# EAGLE design pengendali (EAGLE 7.6.0)
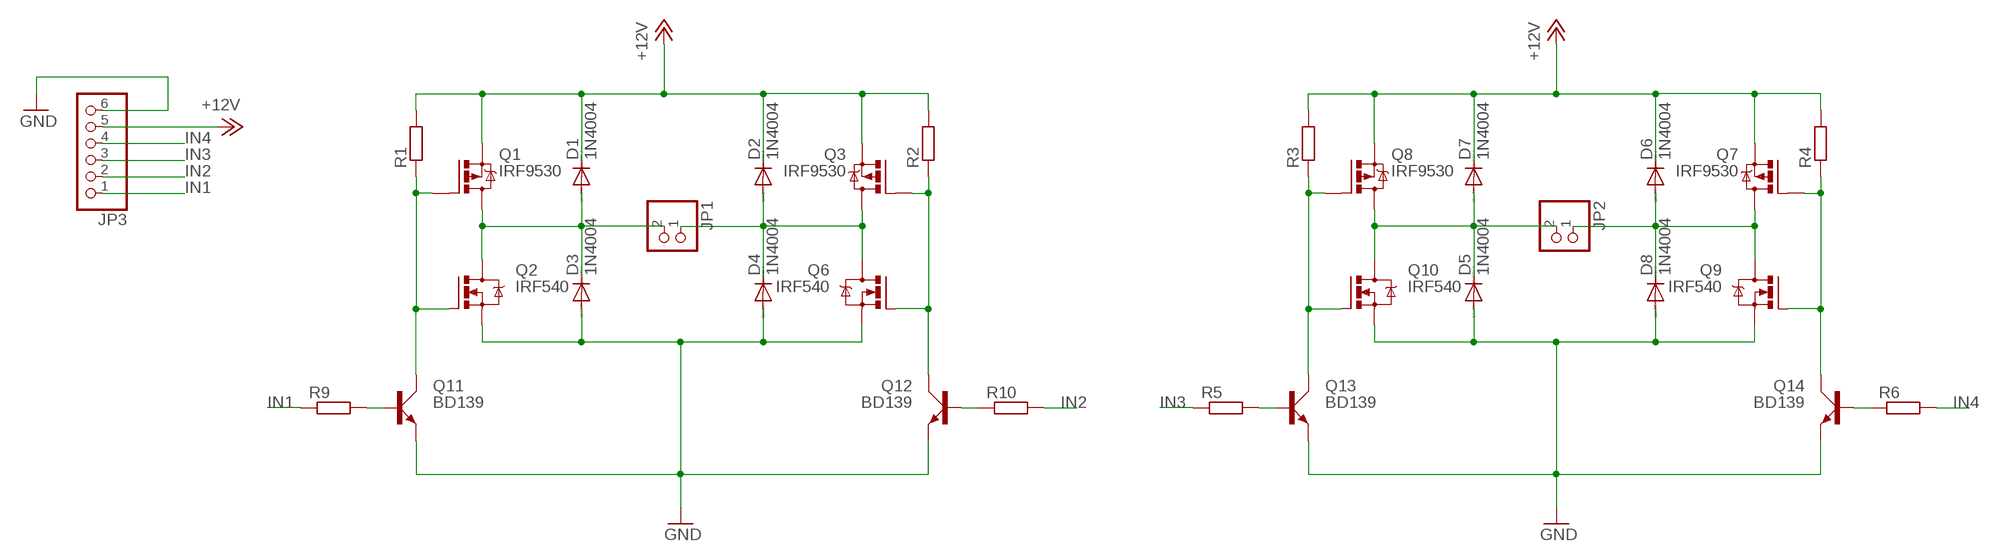
[diagram p0: schematic, sheet 1]

## Parts
D1  1N4004  [DO41-10]
D2  1N4004  [DO41-10]
D3  1N4004  [DO41-10]
D4  1N4004  [DO41-10]
D5  1N4004  [DO41-10]
D6  1N4004  [DO41-10]
D7  1N4004  [DO41-10]
D8  1N4004  [DO41-10]
JP1  PINHD-1X2  [1X02]
JP2  PINHD-1X2  [1X02]
JP3  PINHD-1X6  [1X06]
Q1  IRF9530  [TO220BV]
Q2  IRF540  [TO220BV]
Q3  IRF9530  [TO220BV]
Q6  IRF540  [TO220BV]
Q7  IRF9530  [TO220BV]
Q8  IRF9530  [TO220BV]
Q9  IRF540  [TO220BV]
Q10  IRF540  [TO220BV]
Q11  BD139  [TO126AV]
Q12  BD139  [TO126AV]
Q13  BD139  [TO126AV]
Q14  BD139  [TO126AV]
R1  R-EU_0204/7  [0204/7]
R2  R-EU_0204/7  [0204/7]
R3  R-EU_0204/7  [0204/7]
R4  R-EU_0204/7  [0204/7]
R5  R-EU_0204/7  [0204/7]
R6  R-EU_0204/7  [0204/7]
R9  R-EU_0204/7  [0204/7]
R10  R-EU_0204/7  [0204/7]

## Nets
+12V: D1.C D2.C D6.C D7.C JP3.5 Q1.S Q3.S Q7.S Q8.S R1.2 R2.2 R3.2 R4.2
GND: D3.A D4.A D5.A D8.A JP3.6 Q2.S Q6.S Q9.S Q10.S Q11.E Q12.E Q13.E Q14.E
IN1: JP3.1 R9.1
IN2: JP3.2 R10.2
IN3: JP3.3 R5.1
IN4: JP3.4 R6.2
N$3: Q1.G Q2.G Q11.C R1.1
N$4: Q8.G Q10.G Q13.C R3.1
N$6: Q3.G Q6.G Q12.C R2.1
N$7: Q11.B R9.2
N$8: Q12.B R10.1
N$9: D1.A D3.C JP1.2 Q1.D Q2.D
N$10: D2.A D4.C JP1.1 Q3.D Q6.D
N$11: Q13.B R5.2
N$12: Q14.B R6.1
N$15: Q7.G Q9.G Q14.C R4.1
N$17: D5.C D7.A JP2.2 Q8.D Q10.D
N$18: D6.A D8.C JP2.1 Q7.D Q9.D

## Library data of the parts
D1-D8 = diode:1N4004: DIODE general purpose rectifier, 1 A
JP1 JP2 = pinhead:PINHD-1X2: PIN HEADER
JP3 = pinhead:PINHD-1X6: PIN HEADER
Q1 Q3 Q7 Q8 = transistor-power:IRF9530: P-CHANNEL HEXFET POWER-MOS-FET Source: http://www.irf.com/product-info/datasheets/data/irf9530.pdf
Q2 Q6 Q9 Q10 = transistor-power:IRF540: HEXFET Power MOSFET
Q11-Q14 = transistor-power:BD139: NPN TRANSISTOR
R1-R6 R9 R10 = resistor:R-EU_: RESISTOR, European symbol

## Board
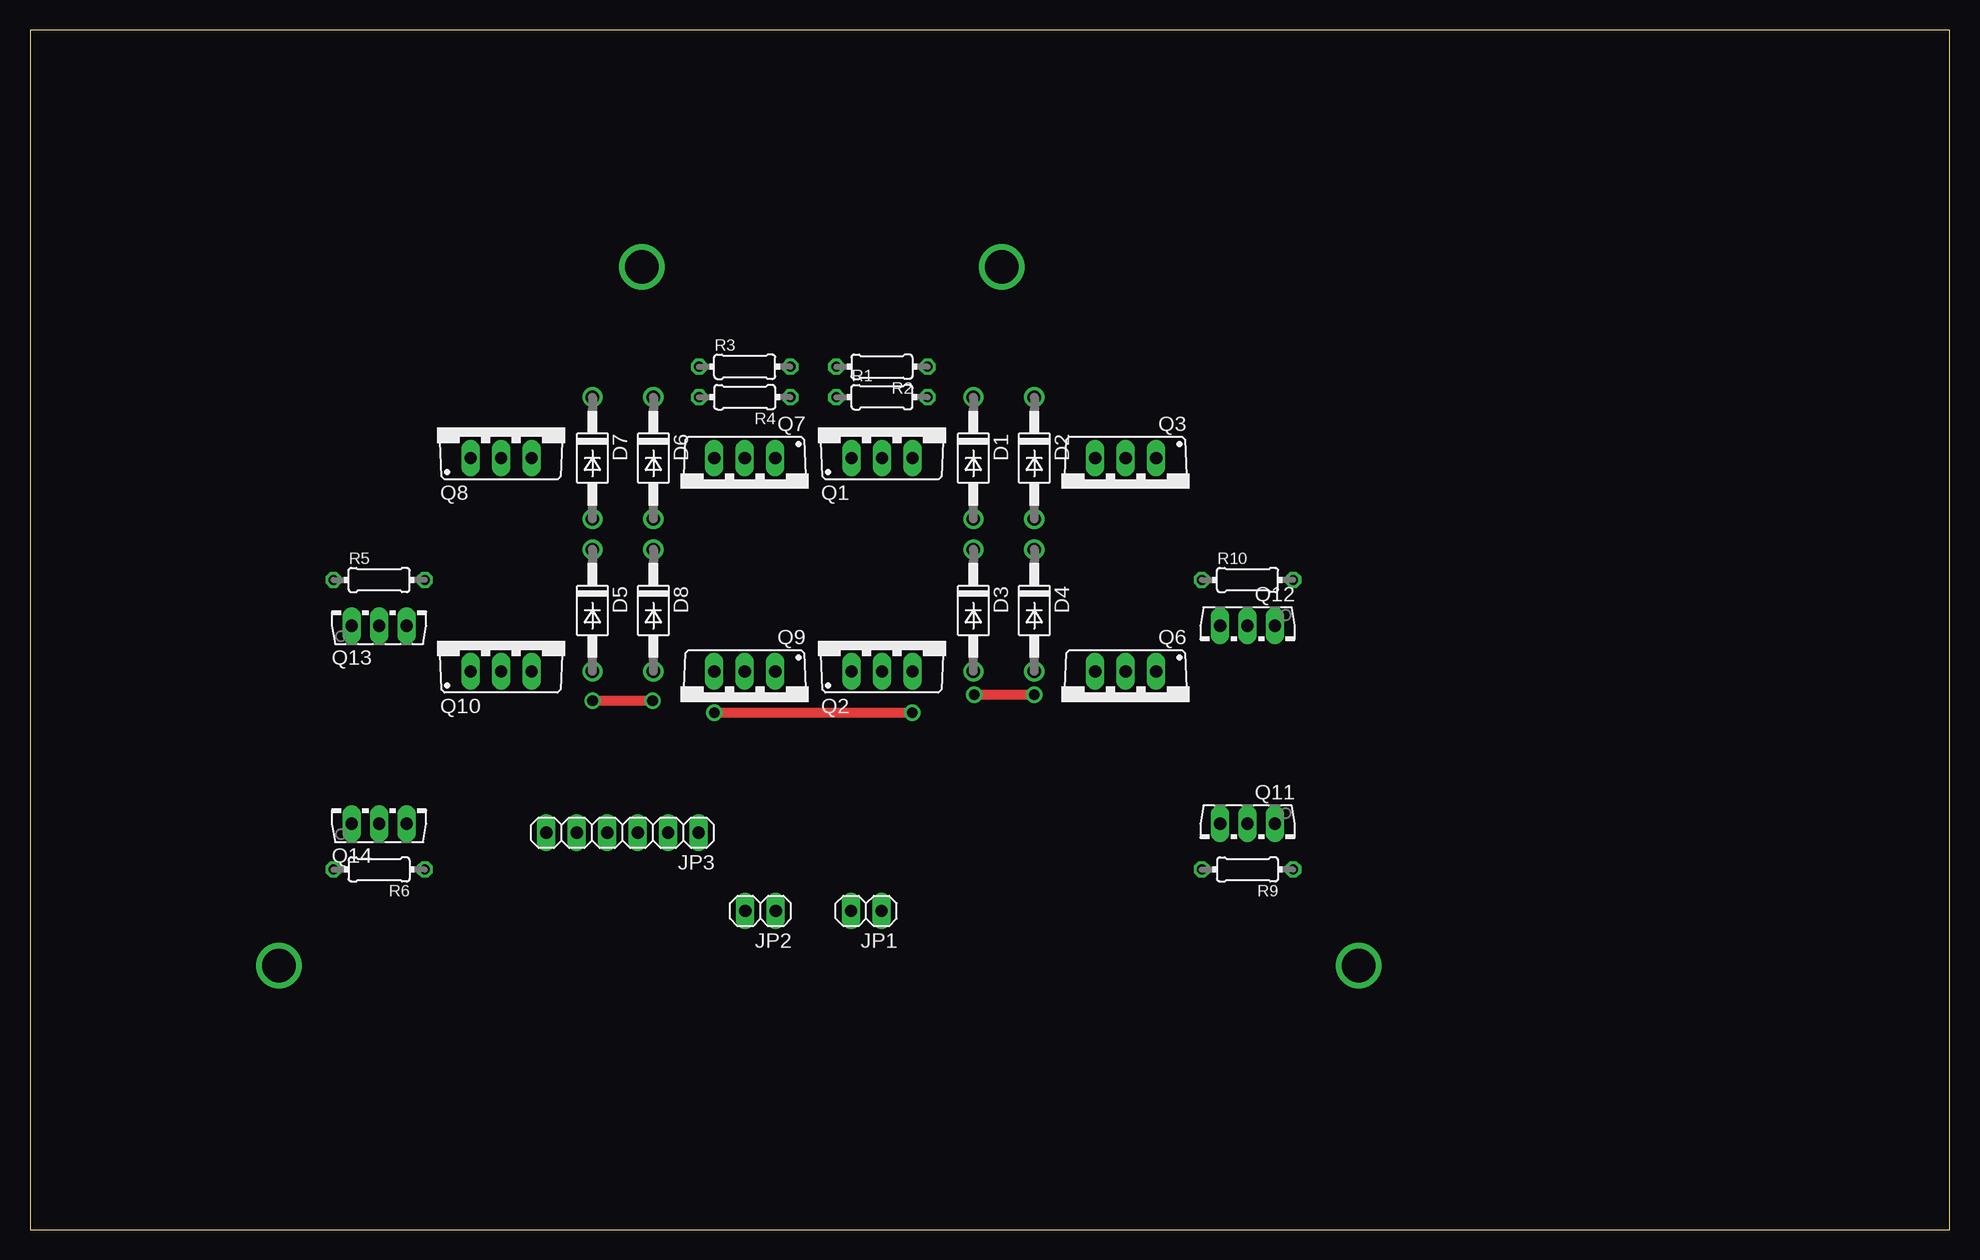
[diagram p1: board, top side]
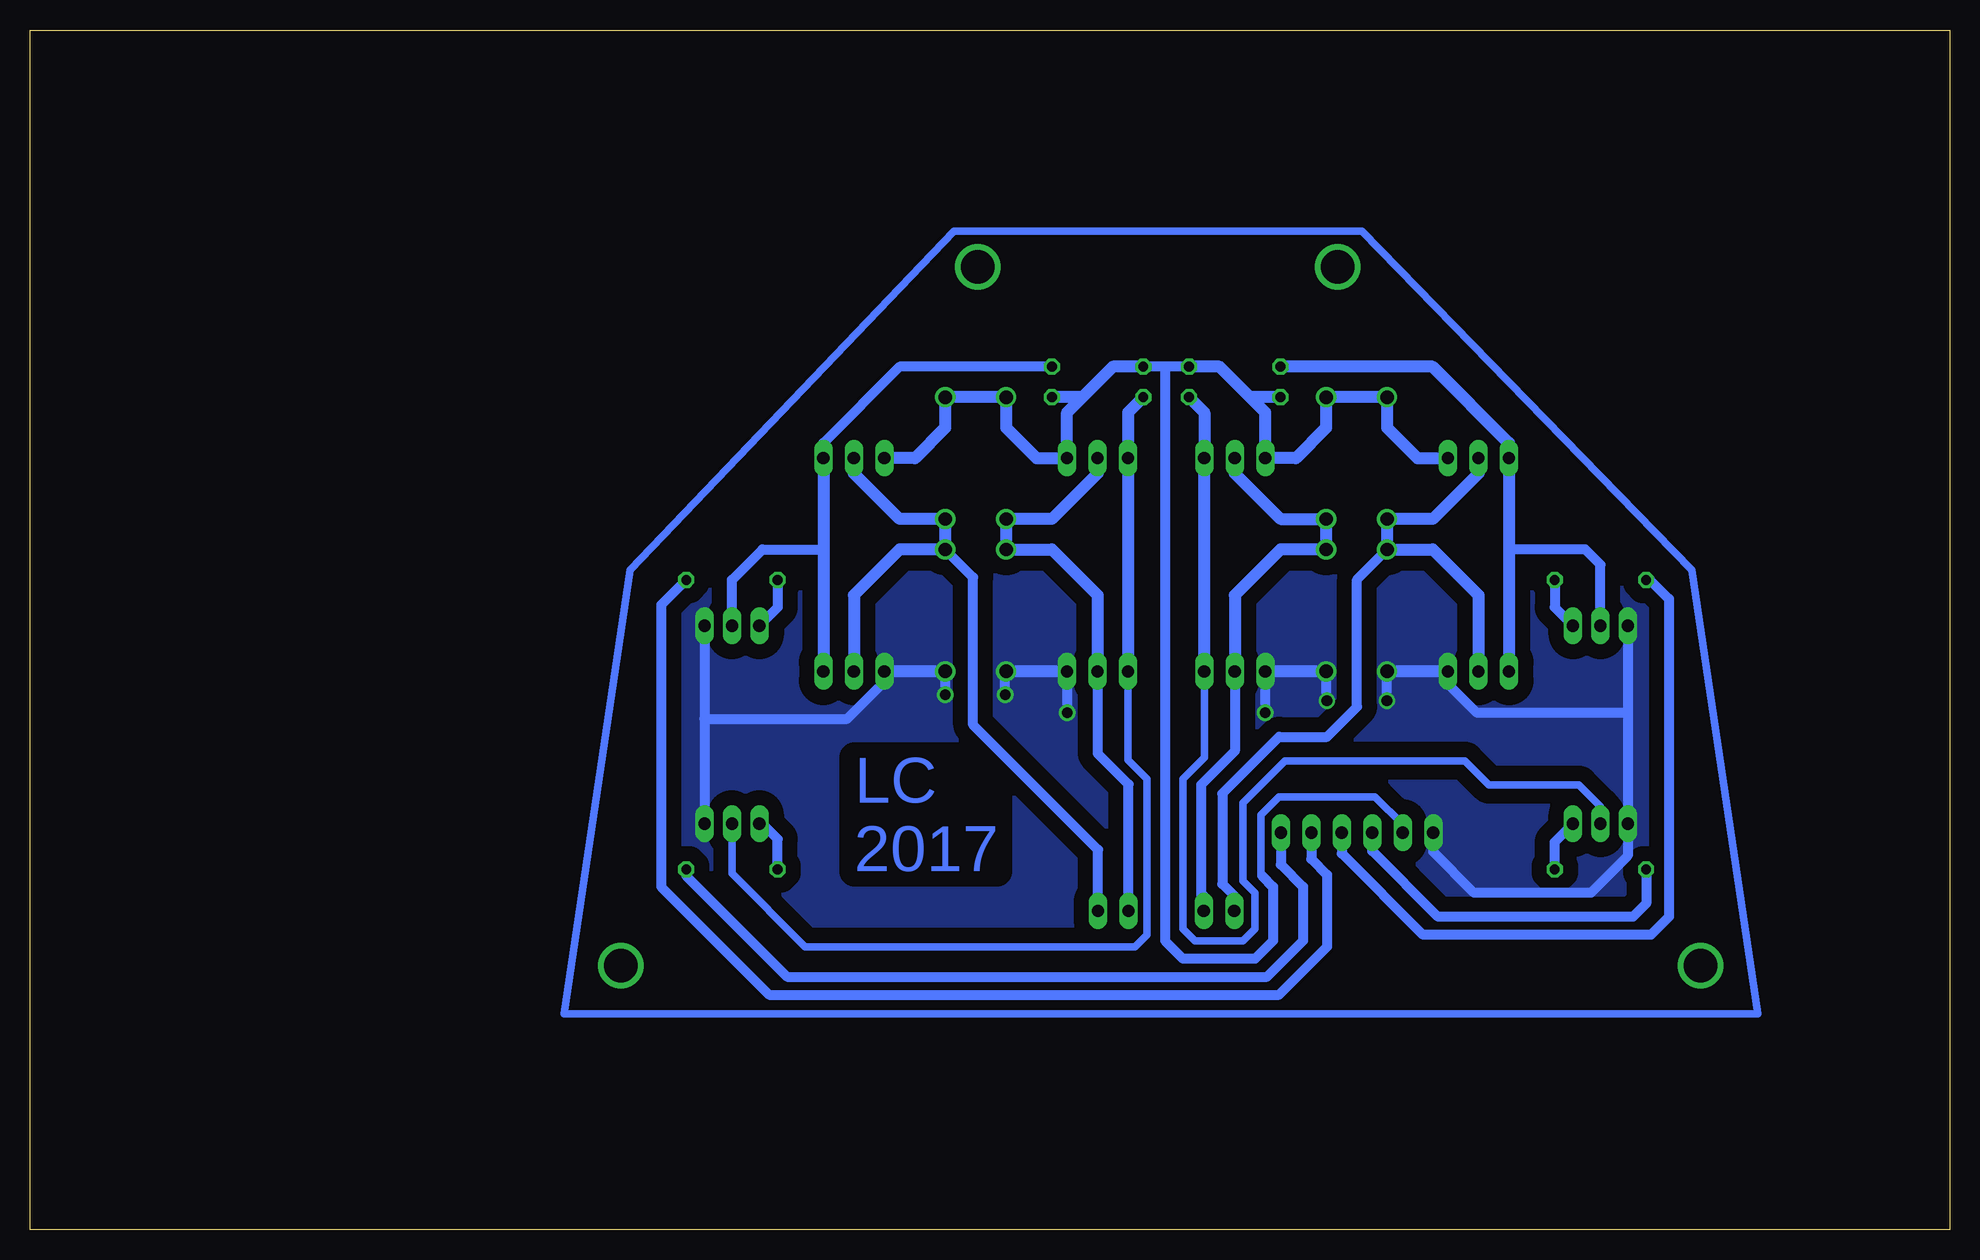
[diagram p2: board, bottom side, seen from below]

Size 160 x 100 mm. Coordinates in mm from the lower left corner, seen from the top.
Outline: 0,0 160,0 160,100 0,100 0,0
Copper layers (1*16): Top 0.035mm / dielectric 1.5mm / Bottom 0.035mm
Design rules "default": minimum track width 10mil, minimum drill 24mil, track to track 8mil, track to pad 8mil, pad to pad 8mil, via to via 8mil, smd to smd 8mil, copper to edge 40mil, drill to drill 8mil, minimum pad ring 10mil, minimum via ring 8mil, stop-mask expansion 4mil, vias tented up to drill 0mil, thermal gap 10mil

### Footprints (pad centres in the part's own frame; a part is rotated, then mirrored left to right if it is on the bottom)
DO41-10 = drill 1.118: A 5.08,0; C -5.08,0
1X02 = drill 1.016 long: 1 -1.27,0; 2 1.27,0
1X06 = drill 1.016 long: 1 -6.35,0; 2 -3.81,0; 3 -1.27,0; 4 1.27,0; 5 3.81,0; 6 6.35,0
TO220BV = drill 1.016 long: D 0,-2.54; G -2.54,-2.54; S 2.54,-2.54
TO126AV = drill 1.016 long: B 2.286,-1.27; C 0,-1.27; E -2.286,-1.27
0204/7 = drill 0.813 octagon: 1 -3.81,0; 2 3.81,0

### Placement (x,y rotation side)
D1  78.63,64.31 270 top
D2  83.71,64.31 270 top
D3  78.63,51.61 270 top
D4  83.71,51.61 270 top
D5  46.88,51.61 270 top
D6  51.96,64.31 270 top
D7  46.88,64.31 270 top
D8  51.96,51.61 270 top
JP1  69.7,26.56 180 top
JP2  60.89,26.56 180 top
JP3  49.39,33.08 180 top
Q1  71.01,66.85 0 top
Q2  71.01,49.07 0 top
Q3  91.33,61.77 180 top
Q6  91.33,43.99 180 top
Q7  59.58,61.77 180 top
Q8  39.26,66.85 0 top
Q9  59.58,43.99 180 top
Q10  39.26,49.07 0 top
Q11  101.49,32.56 180 top
Q12  101.49,49.07 180 top
Q13  29.1,51.61 0 top
Q14  29.1,35.1 0 top
R1  71.01,69.39 0 top
R2  71.01,71.93 180 top
R3  59.58,71.93 0 top
R4  59.58,69.39 180 top
R5  29.1,54.15 0 top
R6  29.1,30.02 180 top
R9  101.49,30.02 180 top
R10  101.49,54.15 0 top

### Tracks (layer width: path | path; a pad name or v marks a point on that pad's centre or on a via)
+12V
  Bottom 0.61: JP3.5 45.58,33.77 47.89,36.08 55.89,36.08 57.39,34.58 57.39,29.58 57.29,29.48
  Bottom 0.813: R3.2 65.39,71.93 | 65.39,71.93 R2.2 | 57.29,29.48 56.39,28.58 56.39,24.08 57.89,22.58 63.89,22.58 65.39,24.08 65.39,71.93
  Bottom 1.016: Q8.S 44.34,64.31 46.88,66.85 D7.C D6.C 51.96,66.85 54.5,64.31 Q7.S 57.04,68.12 58.31,69.39 | Q3.S 86.25,64.31 83.71,66.85 D2.C D1.C 78.63,66.85 76.09,64.31 Q1.S 73.55,68.12 72.28,69.39 | R4.2 58.31,69.39 | 58.31,69.39 60.85,71.93 R3.2 | R2.2 69.74,71.93 72.28,69.39 | 72.28,69.39 R1.2
GND  (via drill 0.9)
  Top 0.813: v51.89,44.08 v46.89,44.08 | v83.71,44.58 v78.71,44.58 | v73.55,43.08 v57.04,43.08
  Bottom 0.813: 26.81,43.08 Q14.E 26.81,31.16 29.89,28.08 39.64,28.08 43.04,31.48 JP3.6 | Q11.E Q12.E 103.78,42.58 91.89,42.58 88.79,45.68 Q6.S | Q13.E 26.81,43.08 | 26.81,43.08 39.39,43.08 41.8,45.49 | 41.8,45.49 41.89,45.58 | Q10.S 41.8,45.49 | D8.A 51.96,44.58 v51.89,44.08 | v46.89,44.08 D5.A | D4.A v83.71,44.58 | v78.71,44.58 78.71,46.45 D3.A | Q2.S v73.55,43.08 | v57.04,43.08 Q9.S
  Bottom 1.016: Q10.S D5.A | D8.A Q9.S | Q2.S D3.A | D4.A Q6.S
  pour Bottom (isolate 1.27, no thermals): 49,83.25 83,83.25 110,55 115.5,18 16,18 21.5,55
IN1
  Bottom 0.813: R9.1 105.3,29.49 96.89,21.08 56.89,21.08 53.89,24.08 53.89,28.58 55.74,30.43 JP3.1
IN2
  Bottom 0.813: R10.2 105.32,54.15 107.39,52.08 107.39,28.58 98.39,19.58 55.89,19.58 51.89,23.58 51.89,29.58 53.2,30.89 JP3.2
IN3
  Bottom 0.813: R5.1 24.96,54.15 23.39,52.58 23.39,26.08 24.89,24.58 43.89,24.58 50.66,31.35 JP3.3
IN4
  Bottom 0.813: R6.2 25.29,27.18 26.39,26.08 42.64,26.08 48.12,31.56 JP3.4
N$1
  Bottom 0.61: 21.5,55 49,83.25 83,83.25 110,55 115.5,18 16,18 21.5,55
N$3
  Bottom 0.61: Q11.C 101.49,29.68 95.39,23.58 67.89,23.58 66.89,24.58 66.89,37.58 68.47,39.16 Q2.G
  Bottom 1.016: Q2.G Q1.G 68.47,68.12 R1.1
N$4
  Bottom 0.813: Q13.C 29.1,55.42 30.37,56.69 36.72,56.69
  Bottom 1.016: Q10.G 36.72,56.69 Q8.G 36.72,65.58 43.07,71.93 R3.1
N$5  (via drill 2.8 pad 2.54)
  other vias: 20.75,22
N$6
  Bottom 0.813: R2.1 87.52,71.93 93.87,65.58 Q3.G | Q12.C 101.49,54.15 98.95,56.69 93.87,56.69
  Bottom 1.016: Q3.G 93.87,56.69 Q6.G
N$7
  Bottom 0.813: R9.2 97.68,32.56 98.95,33.83 Q11.B
N$8
  Bottom 0.813: R10.1 97.68,51.86 Q12.B
N$9
  Bottom 0.813: Q2.D 71.01,39.7 68.43,37.12 JP1.2
  Bottom 1.016: Q1.D 71.01,63.04 74.82,59.23 D1.A D3.C 74.82,56.69 71.01,52.88 Q2.D
N$10
  Bottom 0.813: D4.C 81.39,54.37 81.39,42.08 70.97,31.66 JP1.1
  Bottom 1.016: Q3.D 91.33,63.04 87.52,59.23 D2.A D4.C 87.52,56.69 91.33,52.88 Q6.D
N$11
  Bottom 0.813: R5.2 32.91,51.86 Q13.B
N$12
  Bottom 0.813: R6.1 32.91,32.31 Q14.B
N$14  (via drill 2.8 pad 2.54)
  other vias: 110.75,22
N$15
  Bottom 0.61: Q14.C 29.1,35.29 30.89,37.08 38.39,37.08 40.39,39.08 55.39,39.08 58.89,35.58 58.89,29.08 57.89,28.08 57.89,25.08 58.89,24.08 62.89,24.08 63.89,25.08 63.89,37.58 62.12,39.35 Q9.G
  Bottom 1.016: Q9.G Q7.G 62.12,68.12 R4.1
N$17
  Bottom 0.813: D5.C 49.39,54.18 49.39,43.58 51.89,41.08 55.89,41.08 60.62,36.35 60.62,28.81 59.62,27.81 JP2.2
  Bottom 1.016: Q8.D 39.26,63.04 43.07,59.23 D7.A D5.C 43.07,56.69 39.26,52.88 Q10.D
N$18
  Bottom 0.813: Q9.D 59.58,39.89 62.39,37.08 62.39,27.31 62.16,27.08 | JP2.1 62.16,27.08 | 62.16,27.08 62.16,27.85
  Bottom 1.016: Q7.D 59.58,63.04 55.77,59.23 D6.A D8.C 55.77,56.69 59.58,52.88 Q9.D
N$21  (via drill 2.8 pad 2.54)
  other vias: 51,80.25
N$22  (via drill 2.8 pad 2.54)
  other vias: 81,80.25

### Text on the board
Bottom: LC / 2017